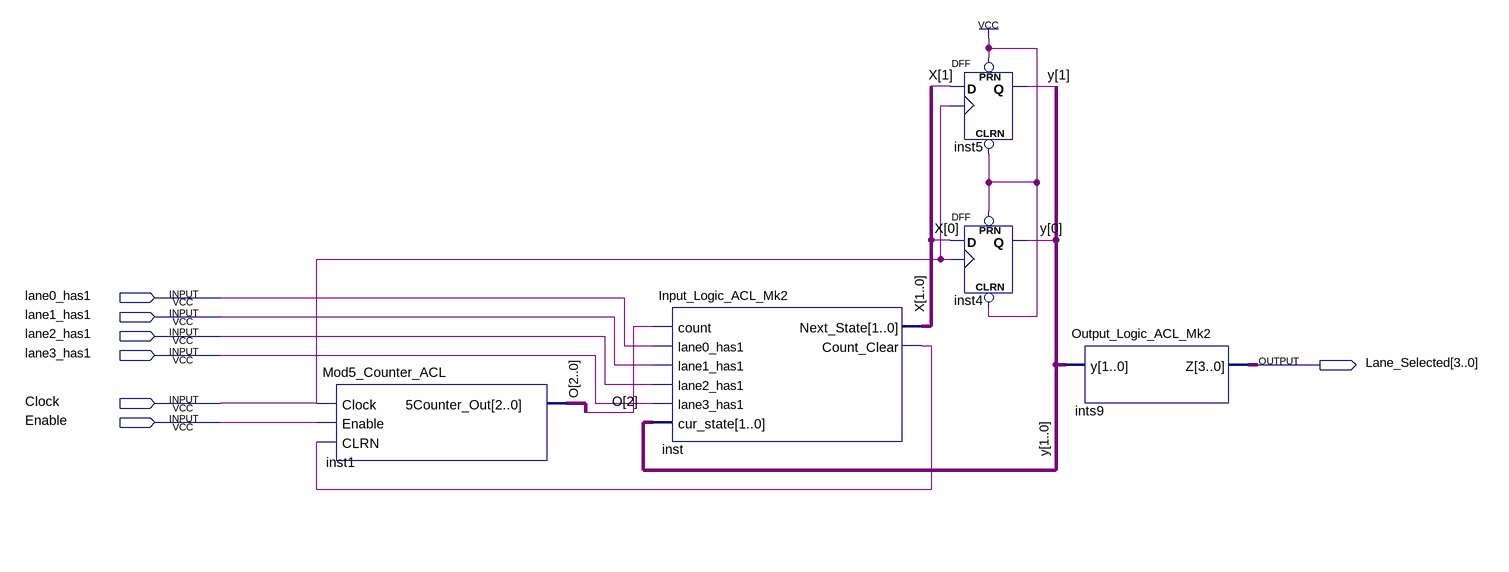
[diagram p0: schematic sheet]
// Quartus schematic ACL_Machine.bdf as structural Verilog: 5 symbols, 7 pins
module ACL_Machine (
  input  lane0_has1,
  input  lane1_has1,
  input  lane2_has1,
  input  lane3_has1,
  input  Clock,
  input  Enable,
  output [3:0] Lane_Selected
);

  wire inst_count_clear;
  wire [1:0] X, y;
  wire [2:0] O;

  Mod5_Counter_ACL inst1 (.Clock(Clock), .Enable(Enable), .CLRN(inst_count_clear), .\5Counter_Out (O));
  Input_Logic_ACL_Mk2 inst (
    .count(O[2]), .lane0_has1(lane0_has1), .lane1_has1(lane1_has1), .lane2_has1(lane2_has1),
    .lane3_has1(lane3_has1), .cur_state(y), .Next_State(X), .Count_Clear(inst_count_clear));
  DFF inst5 (.CLRN(1'b1), .CLK(Clock), .D(X[1]), .PRN(1'b1), .Q(y[1]));
  DFF inst4 (.CLRN(1'b1), .CLK(Clock), .D(X[0]), .PRN(1'b1), .Q(y[0]));
  Output_Logic_ACL_Mk2 ints9 (.y(y), .Z(Lane_Selected));
endmodule
